# Altium project Smart_Door.PrjPcb (part 1 of 2)
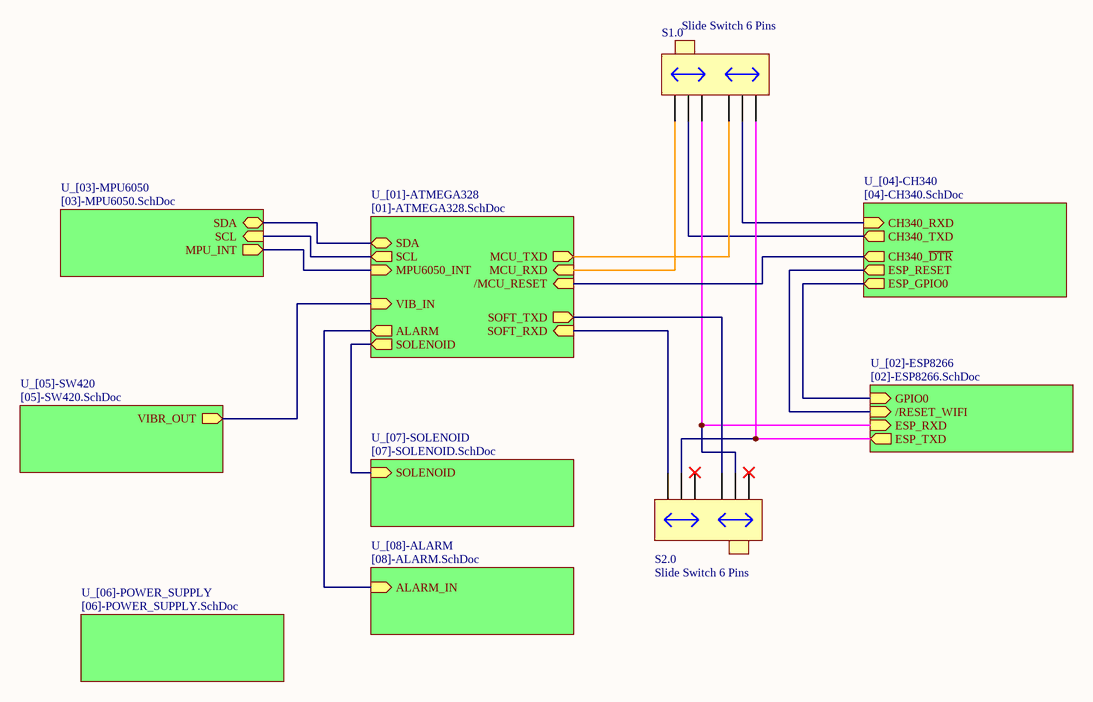
[diagram p0: [00]-Smart_Door.SchDoc]
9 sheets, 111 parts. Net scope: hierarchical (ports join the sheet entries above them; power ports are global).
Board files: Smart_Door.PcbDoc, Smart_Door_Pannel.PcbDoc
Sheets:
  [00]-Smart_Door.SchDoc
    U_[01]-ATMEGA328 = [01]-ATMEGA328.SchDoc
    U_[02]-ESP8266 = [02]-ESP8266.SchDoc
    U_[05]-SW420 = [05]-SW420.SchDoc
    U_[06]-POWER_SUPPLY = [06]-POWER_SUPPLY.SchDoc
    U_[07]-SOLENOID = [07]-SOLENOID.SchDoc
    U_[08]-ALARM = [08]-ALARM.SchDoc
    U_[03]-MPU6050 = [03]-MPU6050.SchDoc
    U_[04]-CH340 = [04]-CH340.SchDoc

## Sheet [00]-Smart_Door.SchDoc
size A4; Organization: Indruino Co., Ltd; Address1: No. 1, Vo Van Ngan Street; Address2: Thu Duc District, HCMC; SheetNumber: 1; SheetTotal: 9

### Parts
S1.0  Slide Switch 6 Pins  [SW6_MSS-22D18]
S2.0  Slide Switch 6 Pins  [SW6_MSS-22D18]

### Sub-sheets
U_[01]-ATMEGA328 = [01]-ATMEGA328.SchDoc: MCU_TXD (out), MCU_RXD (in), ALARM (out), SCL (out), SDA (bidir), SOLENOID (out), VIB_IN (in), SOFT_RXD (in), SOFT_TXD (out), MPU6050_INT (in), /MCU_RESET (in)
U_[02]-ESP8266 = [02]-ESP8266.SchDoc: GPIO0 (in), ESP_TXD (out), ESP_RXD (in), /RESET_WIFI (in)
U_[03]-MPU6050 = [03]-MPU6050.SchDoc: SDA (bidir), SCL (in), MPU_INT (out)
U_[04]-CH340 = [04]-CH340.SchDoc: CH340_TXD (out), CH340_RXD (in), ESP_RESET (out), ESP_GPIO0 (out), CH340_~{DTR} (out)
U_[05]-SW420 = [05]-SW420.SchDoc: VIBR_OUT (out)
U_[06]-POWER_SUPPLY = [06]-POWER_SUPPLY.SchDoc: no entries
U_[07]-SOLENOID = [07]-SOLENOID.SchDoc: SOLENOID (in)
U_[08]-ALARM = [08]-ALARM.SchDoc: ALARM_IN (in)

### Nets
/MCU_RESET: sheet U_[01]-ATMEGA328//MCU_RESET, sheet U_[04]-CH340/CH340_~{DTR}
/RESET_WIFI: sheet U_[02]-ESP8266//RESET_WIFI, sheet U_[04]-CH340/ESP_RESET
ALARM: sheet U_[01]-ATMEGA328/ALARM, sheet U_[08]-ALARM/ALARM_IN
CH340_RXD: S1.0.4(COM) ; sheet U_[04]-CH340/CH340_RXD
CH340_TXD: S1.0.3(COM) ; sheet U_[04]-CH340/CH340_TXD
ESP_GPIO0: sheet U_[02]-ESP8266/GPIO0, sheet U_[04]-CH340/ESP_GPIO0
MCU_RXD: S1.0.1(NC) ; sheet U_[01]-ATMEGA328/MCU_RXD
MCU_TXD: S1.0.2(NC) ; sheet U_[01]-ATMEGA328/MCU_TXD
MPU6050_INT: sheet U_[01]-ATMEGA328/MPU6050_INT, sheet U_[03]-MPU6050/MPU_INT
SCL: sheet U_[01]-ATMEGA328/SCL, sheet U_[03]-MPU6050/SCL
SDA: sheet U_[01]-ATMEGA328/SDA, sheet U_[03]-MPU6050/SDA
SOFT_RXD: S2.0.6(NO) ; sheet U_[01]-ATMEGA328/SOFT_RXD
SOFT_TXD: S2.0.5(NO) ; sheet U_[01]-ATMEGA328/SOFT_TXD
SOLENOID: sheet U_[01]-ATMEGA328/SOLENOID, sheet U_[07]-SOLENOID/SOLENOID
VIB_IN: sheet U_[01]-ATMEGA328/VIB_IN, sheet U_[05]-SW420/VIBR_OUT
NetS1.0_5: S1.0.5(NO) S2.0.3(COM) ; sheet U_[02]-ESP8266/ESP_RXD
NetS1.0_6: S1.0.6(NO) S2.0.4(COM) ; sheet U_[02]-ESP8266/ESP_TXD

Not connected (* = marked no-connect by the designer): S2.0 1(NC)* 2(NC)*

### Notes on the sheet
- Title
- Size:
- Date:
- Author:
- A4
- Time:
- Number:
- Checked:
- Revision:
- Sheet
- Approved:
- of
- File:

### Library data of the parts
S1.0 S2.0 = Slide Switch 6 Pins: Switch; Published: 24-Mar-1999; LatestRevisionDate: 17-Jul-2002; LatestRevisionNote: Re-released for DXP Platform.; PackageReference: SPST-2; Publisher: Altium Limited

## Sheet [01]-ATMEGA328.SchDoc
size A4; Organization: Indruino Co., Ltd; Address1: No. 1, Vo Van Ngan Street; Address2: Thu Duc District, HCMC; SheetNumber: 2; SheetTotal: 9
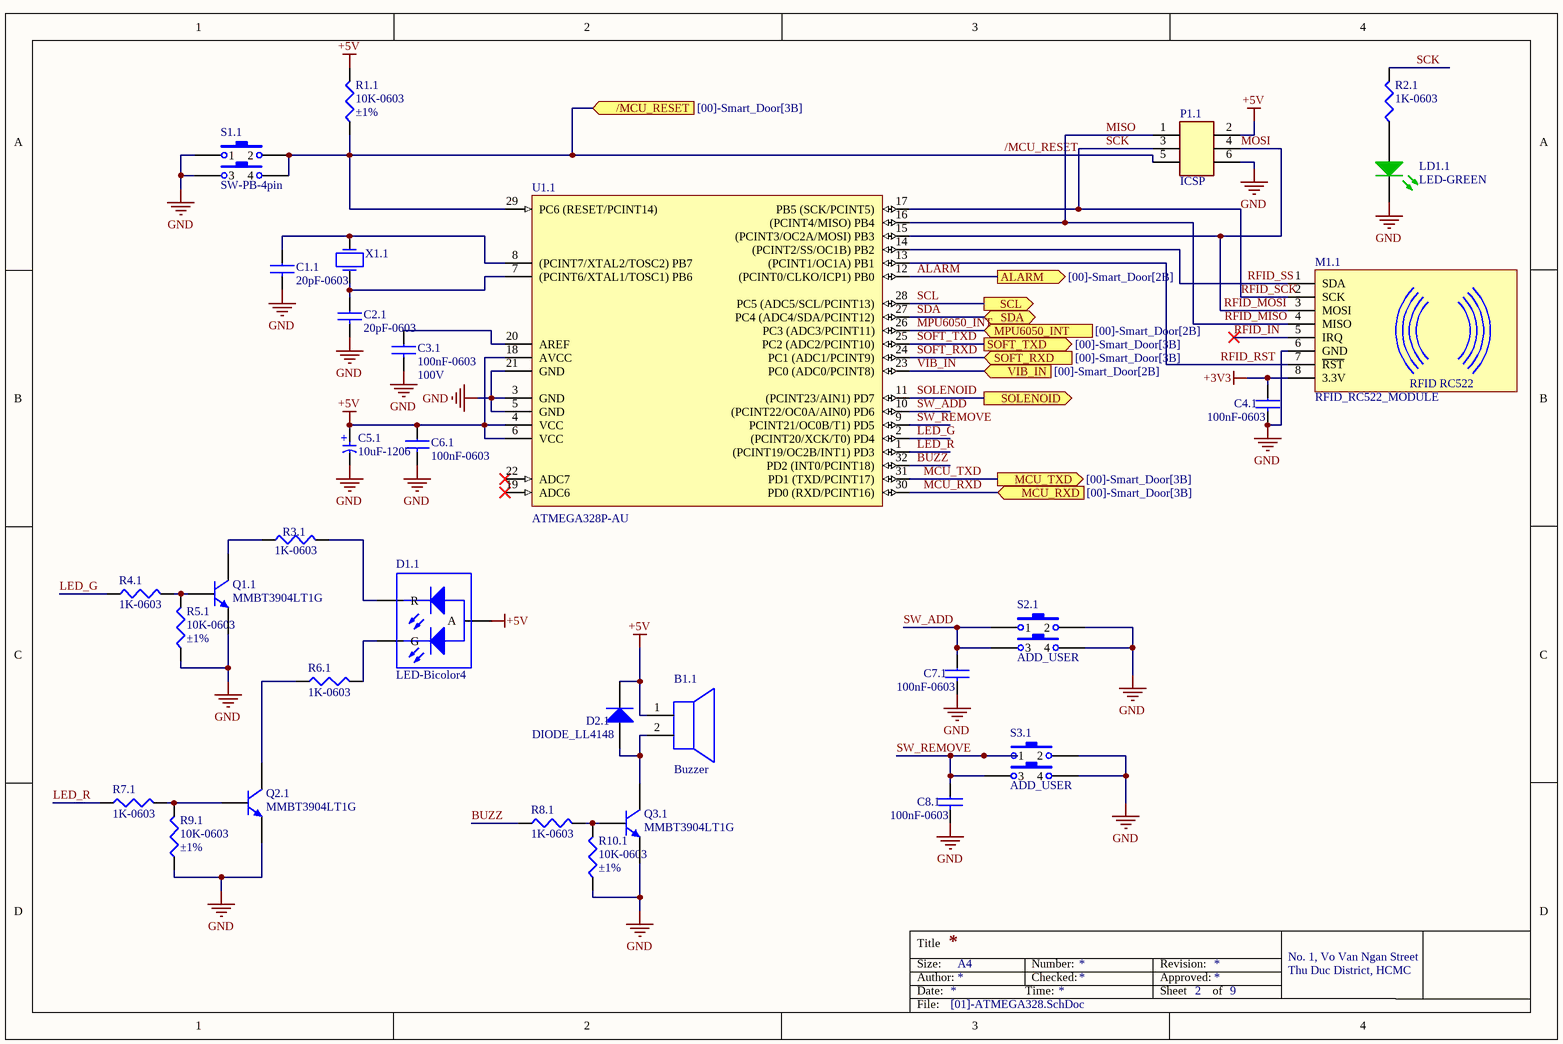
[diagram p1: [01]-ATMEGA328.SchDoc]

### Parts
B1.1  Buzzer  [Buzzer]
C1.1  20pF-0603  [CAP0603]
C2.1  20pF-0603  [CAP0603]
C3.1  100nF-0603  Voltage - Rated: 100V  [CAP0603]
C4.1  100nF-0603  [CAP0603]
C5.1  10uF-1206  [CAP1206_TANT]
C6.1  100nF-0603  [CAP0603]
C7.1  100nF-0603  [CAP0603]
C8.1  100nF-0603  [CAP0603]
D1.1  LED-Bicolor4  [LED_3mm-Bicolor]
D2.1  DIODE_LL4148  [SOD80]
LD1.1  LED-GREEN  [LED_SMD0603_GREEN]
M1.1  RFID_RC522_MODULE  [RFID_RC522_MODULE]
P1.1  ICSP  [HDR3X2_2.54_MALE]
Q1.1  MMBT3904LT1G  [SOT23-3]
Q2.1  MMBT3904LT1G  [SOT23-3]
Q3.1  MMBT3904LT1G  [SOT23-3]
R1.1  10K-0603  Tolerance: ±1%  [RES0603]
R2.1  1K-0603  [RES0603]
R3.1  1K-0603  [RES0603]
R4.1  1K-0603  [RES0603]
R5.1  10K-0603  Tolerance: ±1%  [RES0603]
R6.1  1K-0603  [RES0603]
R7.1  1K-0603  [RES0603]
R8.1  1K-0603  [RES0603]
R9.1  10K-0603  Tolerance: ±1%  [RES0603]
R10.1  10K-0603  Tolerance: ±1%  [RES0603]
S1.1  SW-PB-4pin  [SW4-KAN0647-0312B]
S2.1  ADD_USER  [SW4-KAN0647-0312B]
S3.1  ADD_USER  [SW4-KAN0647-0312B]
U1.1  ATMEGA328P-AU  [TQFP-32]
X1.1  9C-16.000MAAE-T  [XTAL_SMD_HC-49S]  (value not drawn)

### Ports
/MCU_RESET (in, see [00]-Smart_Door[3B]), ALARM (out, see [00]-Smart_Door[2B]), MCU_RXD (in, see [00]-Smart_Door[3B]), MCU_TXD (out, see [00]-Smart_Door[3B]), MPU6050_INT (in, see [00]-Smart_Door[2B]), SCL (out, see [00]-Smart_Door[2B], [03]-MPU6050[1B]), SDA (bidir, see [00]-Smart_Door[2B], [03]-MPU6050[1A]), SOFT_RXD (in, see [00]-Smart_Door[3B]), SOFT_TXD (out, see [00]-Smart_Door[3B]), SOLENOID (out, see [00]-Smart_Door[2B], [07]-SOLENOID[2B]), VIB_IN (in, see [00]-Smart_Door[2B])

### Nets
+3V3: C4.1.1 M1.1.8(3.3V)
+5V: B1.1.1(+) C5.1.1 C6.1.1 D1.1.2(A) D2.1.2(K) P1.1.2 R1.1.2 U1.1.4(VCC) U1.1.6(VCC) U1.1.18(AVCC)
GND: C1.1.2 C2.1.2 C3.1.2 C4.1.2 C5.1.2 C6.1.2 C7.1.2 C8.1.2 LD1.1.2(K) M1.1.6(GND) P1.1.6 Q1.1.2(E) Q2.1.2(E) Q3.1.2(E) R5.1.1 R9.1.1 R10.1.1 S1.1.1 S1.1.3 S2.1.2 S2.1.4 S3.1.2 S3.1.4 U1.1.3(GND) U1.1.5(GND) U1.1.21(GND)
/MCU_RESET: P1.1.5 R1.1.1 S1.1.2 S1.1.4 U1.1.29(PC6_(RESET/PCINT14)) ; port /MCU_RESET
ALARM: U1.1.12((PCINT0/CLKO/ICP1)_PB0) ; port ALARM
BUZZ: R8.1.1 U1.1.32(PD2_(INT0/PCINT18))
LED_G: R4.1.1 U1.1.2((PCINT20/XCK/T0)_PD4)
LED_R: R7.1.1 U1.1.1((PCINT19/OC2B/INT1)_PD3)
MCU_RXD: U1.1.30(PD0_(RXD/PCINT16)) ; port MCU_RXD
MCU_TXD: U1.1.31(PD1_(TXD/PCINT17)) ; port MCU_TXD
MISO: M1.1.4(MISO) P1.1.1 U1.1.16((PCINT4/MISO)_PB4)  [also labelled RFID_MISO]
MOSI: M1.1.3(MOSI) P1.1.4 U1.1.15((PCINT3/OC2A/MOSI)_PB3)  [also labelled RFID_MOSI]
MPU6050_INT: U1.1.26(PC3_(ADC3/PCINT11)) ; port MPU6050_INT
RFID_IN: M1.1.5(IRQ)
RFID_RST: M1.1.7(~{RST}) U1.1.13((PCINT1/OC1A)_PB1)
RFID_SCK: M1.1.2(SCK) P1.1.3 R2.1.2 U1.1.17(PB5_(SCK/PCINT5))  [also labelled SCK]
RFID_SS: M1.1.1(SDA) U1.1.14((PCINT2/SS/OC1B)_PB2)
SCL: U1.1.28(PC5_(ADC5/SCL/PCINT13)) ; port SCL
SDA: U1.1.27(PC4_(ADC4/SDA/PCINT12)) ; port SDA
SOFT_RXD: U1.1.24(PC1_(ADC1/PCINT9)) ; port SOFT_RXD
SOFT_TXD: U1.1.25(PC2_(ADC2/PCINT10)) ; port SOFT_TXD
SOLENOID: U1.1.11((PCINT23/AIN1)_PD7) ; port SOLENOID
SW_ADD: C7.1.1 S2.1.1 S2.1.3 U1.1.10((PCINT22/OC0A/AIN0)_PD6)
SW_REMOVE: C8.1.1 S3.1.1 S3.1.3 U1.1.9(PCINT21/OC0B/T1)_PD5)
VIB_IN: U1.1.23(PC0_(ADC0/PCINT8)) ; port VIB_IN
NetB1.1_2: B1.1.2(-) D2.1.1(A) Q3.1.3(C)
NetC1.1_1: C1.1.1 U1.1.8((PCINT7/XTAL2/TOSC2)_PB7) X1.1.2(OSC2)
NetC2.1_1: C2.1.1 U1.1.7((PCINT6/XTAL1/TOSC1)_PB6) X1.1.1(OSC1)
NetC3.1_1: C3.1.1 U1.1.20(AREF)
NetD1.1_1: D1.1.1(G) R6.1.2
NetD1.1_3: D1.1.3(R) R3.1.2
NetLD1.1_1: LD1.1.1(A) R2.1.1
NetQ1.1_1: Q1.1.1(B) R4.1.2 R5.1.2
NetQ1.1_3: Q1.1.3(C) R3.1.1
NetQ2.1_1: Q2.1.1(B) R7.1.2 R9.1.2
NetQ2.1_3: Q2.1.3(C) R6.1.1
NetQ3.1_1: Q3.1.1(B) R8.1.2 R10.1.2

Not connected (* = marked no-connect by the designer): U1.1 19(ADC6)* 22(ADC7)*

### Notes on the sheet
- Title
- Size:
- Date:
- Author:
- A4
- Time:
- Number:
- Checked:
- Revision:
- Sheet
- Approved:
- of
- File:
- (in symbol RFID_RC522_MODULE) RFID RC522
- (in symbol T491A106K016AT) +

### Library data of the parts
C1.1 C2.1 = CC0603JRNPO9BN200: CAP CER 20PF 50V C0G/NPO 0603; Manufacturer 1: Yageo; Category 1: Capacitors; Tolerance: ±5%; Temperature Coefficient: C0G, NP0; Supplier 1: Digi-Key; Supplier Part Number 1: 311-1424-1-ND; Manufacturer Part Number 1: CC0603JRNPO9BN200; RoHS 1: RoHS Compliant; Description 1: CAP CER 20PF 50V C0G/NPO 0603; Stock 1: 67895; Pricing 1: 1=0.1, 10=0.037, 100=0.0164, 500=0.01172, 1000=0.0092 (USD); Packaging: Cut Tape (CT); Part Status: Active; Capacitance: 20pF; Voltage - Rated: 50V; Operating Temperature: -55°C ~ 125°C; Features: -; Ratings: -; Applications: General Purpose; Failure Rate: -; Mounting Type: Surface Mount, MLCC; Package / Case: 0603 (1608 Metric); Size / Dimension: 0.063" L x 0.031" W (1.60mm x 0.80mm); Height - Seated (Max): -; Thickness (Max): 0.035" (0.90mm); Lead Spacing: -; Lead Style: -; ComponentLink1URL: http://www.yageo.com/documents/recent/UPY-GP_NP0_16V-to-50V_16.pdf; ComponentLink1Description: http://www.yageo.com/documents/recent/UPY-GP_NP0_16V-to-50V_16.pdf; Value: 20pF
C3.1 C6.1 = CC0603KRX7R0BB104: CAP CER 0.1UF 100V X7R 0603; Manufacturer: Yageo; Tolerance: ±10%; Value: 100nF; Supplier 1: Digi-Key; Manufacturer Part Number: CC0603KRX7R0BB104; RoHS: RoHS Compliant; Category: Capacitors; Stock 1: 784508; Pricing 1: 1=0.23, 10=0.156, 100=0.0791, 500=0.05414, 1000=0.0479 (USD); Packaging: Cut Tape (CT); Part Status: Active; Temperature Coefficient: X7R; Operating Temperature: -55°C ~ 125°C; Features: -; Ratings: -; Applications: General Purpose; Failure Rate: -; Mounting Type: Surface Mount, MLCC; Package / Case: 0603 (1608 Metric); Size / Dimension: 0.063" L x 0.032" W (1.60mm x 0.80mm); Height - Seated (Max): -; Thickness (Max): 0.035" (0.90mm); Lead Spacing: -; Lead Style: -; ComponentLink1URL: http://media.digikey.com/pdf/Data%20Sheets/Yageo%20PDFs/NPO,%20X7R%20Mid-voltage.pdf; ComponentLink1Description: http://media.digikey.com/pdf/Data%20Sheets/Yageo%20PDFs/NPO,%20X7R%20Mid-voltage.pdf; Supplier Part Number 1: 311-1523-1-ND
  C6.1: Voltage - Rated: 100V
C4.1 C7.1 C8.1 = CC0603KRX7R9BB104: CAP CER 0.1UF 50V X7R 0603; Manufacturer 1: Yageo; Category 1: Capacitors; Capacitance: 0.1µF; Tolerance: ±10%; Value: 100nF; Supplier 1: Digi-Key; Supplier Part Number 1: 311-1344-1-ND; Manufacturer Part Number 1: CC0603KRX7R9BB104; RoHS 1: RoHS Compliant; Description 1: CAP CER 0.1UF 50V X7R 0603; Stock 1: 4411645; Pricing 1: 1=0.1, 10=0.031, 100=0.014, 500=0.00998, 1000=0.00783 (USD); Packaging: Cut Tape (CT); Part Status: Active; Voltage - Rated: 50V; Temperature Coefficient: X7R; Operating Temperature: -55°C ~ 125°C; Features: -; Ratings: -; Applications: General Purpose; Failure Rate: -; Mounting Type: Surface Mount, MLCC; Package / Case: 0603 (1608 Metric); Size / Dimension: 0.063" L x 0.031" W (1.60mm x 0.80mm); Height - Seated (Max): -; Thickness (Max): 0.035" (0.90mm); Lead Spacing: -; Lead Style: -; ComponentLink1URL: http://www.yageo.com/documents/recent/UPY-GPHC_X7R_6.3V-to-50V_18.pdf; ComponentLink1Description: http://www.yageo.com/documents/recent/UPY-GPHC_X7R_6.3V-to-50V_18.pdf
C5.1 = T491A106K016AT: Cap Tant Solid 10uF 16V A CASE 10% (3.2 X 1.6 X 1.6mm) Inward L SMD 3216-18 3 Ohm 125C T/R; Manufacturer 1: KEMET; Dielectric Material: Tantalum; ESR (Equivalent Series Resistance): 7R; Ripple Current: 104mA; Leakage Current: 1.6uA; Polarity: Polar; Life (Hours): 2000Hour; Supplier 1: Digi-Key; Supplier Part Number 1: 399-8269-1-ND; Manufacturer Part Number 1: T491A106K016AT; RoHS 1: Yes; Description 1: Cap Tant Solid 10uF 16V A CASE 10% (3.2 X 1.6 X 1.6mm) Inward L SMD 3216-18 3 Ohm 125C T/R; Category: Tantalum Capacitors; Stock 1: 3206; Pricing 1: 1=0.45000, 10=0.31300, 50=0.21900, 100=0.18780, 500=0.14082, 1000=0.11892 (USD); Mount: Surface Mount,PCB; Case/Package: 1206; Number of Pins: 2; Case Code (Metric): 3216; Case Code (Imperial): 1206; Min Operating Temperature: -55°C; Max Operating Temperature: 125°C; Capacitance: 10uF; Tolerance: 10%; Voltage Rating: 16V; Packaging: Tape and Reel; Termination: SMD/SMT; Voltage: 16V; Package Quantity: 1; Voltage Rating (DC): 16V; Dissipation Factor: 10%; Failure Rate: 0.001%; Features: General Purpose; Length: 3.2mm; Width: 1.6mm; Height: 1.6mm; Depth: 1.6mm; Height - Seated (Max): 0.071inch; Lead Pitch: 1.2mm; Radiation Hardening: No; RoHS Compliant: Yes; REACH SVHC: No SVHC; Lead Free: Lead Free; ComponentLink1URL: https://datasheet.ciiva.com/7696/1732745-7696294.pdf?src-supplier=Element14; ComponentLink1Description: https://datasheet.ciiva.com/7696/1732745-7696294.pdf?src-supplier=Element14; ComponentLink2URL: https://datasheet.ciiva.com/34302/1573257-34302505.pdf?src-supplier=Jameco; ComponentLink2Description: https://datasheet.ciiva.com/34302/1573257-34302505.pdf?src-supplier=Jameco; ComponentLink3URL: https://datasheet.ciiva.com/7696/1923792-7696431.pdf?src-supplier=Element14; ComponentLink3Description: https://datasheet.ciiva.com/7696/1923792-7696431.pdf?src-supplier=Element14; ComponentLink4URL: https://datasheet.ciiva.com/7696/1854511-7696295.pdf?src-supplier=Element14; ComponentLink4Description: https://datasheet.ciiva.com/7696/1854511-7696295.pdf?src-supplier=Element14; ComponentLink5URL: https://datasheet.ciiva.com/14113/t491serie-eng-tds-14113132.pdf?src-supplier=Distrelec; ComponentLink5Description: https://datasheet.ciiva.com/14113/t491serie-eng-tds-14113132.pdf?src-supplier=Distrelec; ComponentLink6URL: https://datasheet.ciiva.com/7696/1446014-7696296.pdf?src-supplier=Element14; ComponentLink6Description: https://datasheet.ciiva.com/7696/1446014-7696296.pdf?src-supplier=Element14; ComponentLink7URL: https://datasheet.ciiva.com/7696/1854511-7696293.pdf?src-supplier=Element14; ComponentLink7Description: https://datasheet.ciiva.com/7696/1854511-7696293.pdf?src-supplier=Element14; ComponentLink8URL: https://datasheet.ciiva.com/6248/kem-t2005-t491-6248088.pdf?src-supplier=Digi-Key; ComponentLink8Description: https://datasheet.ciiva.com/6248/kem-t2005-t491-6248088.pdf?src-supplier=Digi-Key; ComponentLink9URL: https://datasheet.ciiva.com/6248/kem-t2005-t491-6248087.pdf?src-supplier=Digi-Key; ComponentLink9Description: https://datasheet.ciiva.com/6248/kem-t2005-t491-6248087.pdf?src-supplier=Digi-Key; ComponentLink10URL: https://datasheet.ciiva.com/6248/kem-t2005-t491-6248089.pdf?src-supplier=Digi-Key; ComponentLink10Description: https://datasheet.ciiva.com/6248/kem-t2005-t491-6248089.pdf?src-supplier=Digi-Key; ComponentLink11URL: https://datasheet.ciiva.com/14586/70095774-14586694.pdf?src-supplier=Allied+Electronics; ComponentLink11Description: https://datasheet.ciiva.com/14586/70095774-14586694.pdf?src-supplier=Allied+Electronics; ComponentLink12URL: https://datasheet.ciiva.com/14605/70095774-14605543.pdf?src-supplier=Allied+Electronics; ComponentLink12Description: https://datasheet.ciiva.com/14605/70095774-14605543.pdf?src-supplier=Allied+Electronics; ComponentLink13URL: https://datasheet.ciiva.com/12882/kem-t2005-t491-12882730.pdf?src-supplier=Mouser; ComponentLink13Description: https://datasheet.ciiva.com/12882/kem-t2005-t491-12882730.pdf?src-supplier=Mouser; ComponentLink14URL: https://datasheet.ciiva.com/29244/458306-da-01-de-kondensator-10uf-3216-10pr-16v-85c-29244588.pdf?src-supplier=Conrad; ComponentLink14Description: https://datasheet.ciiva.com/29244/458306-da-01-de-kondensator-10uf-3216-10pr-16v-85c-29244588.pdf?src-supplier=Conrad
D1.1 = LED-Bicolor4: Common Anode; Published: 8-Jun-2000; LatestRevisionDate: 08-Jul-2005; LatestRevisionNote: Mech Layer 1 removed.; PackageReference: LED-0; Publisher: Altium Limited
D2.1 = DIODE_LL4148: DIODE GEN PURP 100V 200MA SOD80; Manufacturer: Fairchild/ON Semiconductor; Manufacturer Part Number: LL4148; Diode Type: Standard; Voltage - Forward (Vf) (Max) @ If: 1V @ 10mA; Speed: Small Signal =< 200mA (Io), Any Speed; Current - Reverse Leakage @ Vr: 25nA @ 20V; Capacitance @ Vr, F: 4pF @ 0V, 1MHz; Supplier 1: Digi-Key; RoHS: RoHS Compliant; Category: Discrete Semiconductor Products; Stock 1: 494912; Pricing 1: 1=0.1, 10=0.095, 100=0.0518, 500=0.03188, 1000=0.02174 (USD); Packaging: Cut Tape (CT); Part Status: Active; Current - Average Rectified (Io): 200mA; Mounting Type: Surface Mount; Package / Case: DO-213AC, MINI-MELF, SOD-80; Supplier Device Package: SOD-80; Operating Temperature - Junction: -55°C ~ 175°C; ComponentLink1URL: https://www.fairchildsemi.com/datasheets/LL/LL4148.pdf; ComponentLink1Description: https://www.fairchildsemi.com/datasheets/LL/LL4148.pdf; Supplier Part Number 1: LL4148FSCT-ND
LD1.1 = LED_LTST-C191KGKT: LED GREEN CLEAR 0603 SMD; Manufacturer 1: Lite-On Inc.; Category 1: Optoelectronics; Lens Color: Colorless; Millicandela Rating: 35mcd; Lens Style/Size: Rectangle with Flat Top, 1.10mm x 0.80mm; Voltage - Forward (Vf) (Typ): 2V; Current - Test: 20mA; Viewing Angle: 130°; Wavelength - Dominant: 571nm; Wavelength - Peak: 574nm; Supplier 1: Digi-Key; Supplier Part Number 1: 160-1446-1-ND; Manufacturer Part Number 1: LTST-C191KGKT; RoHS 1: RoHS Compliant; Description 1: LED GREEN CLEAR 0603 SMD; Stock 1: 1325167; Pricing 1: 1=0.29, 10=0.211, 25=0.1556, 100=0.1111, 250=0.07556, 500=0.06666, 1000=0.05222, 2500=0.05111 (USD); Packaging: Cut Tape (CT); Part Status: Active; Color: Green; Lens Transparency: Clear; Mounting Type: Surface Mount; Features: -; Size / Dimension: 1.60mm L x 0.80mm W; Height (Max): 0.55mm; ComponentLink1URL: http://optoelectronics.liteon.com/upload/download/DS22-2000-228/S_110_LTST-C191KGKT.pdf; ComponentLink1Description: http://optoelectronics.liteon.com/upload/download/DS22-2000-228/S_110_LTST-C191KGKT.pdf; Package / Case: 0603 (1608 Metric)
P1.1 = HDR3X2_2.54_MALE: Header 3x2 pins male, pitch 2.54mm
Q1.1 Q2.1 Q3.1 = MMBT3904LT1G: TRANS NPN 40V 0.2A SOT23; Manufacturer 1: ON Semiconductor; Category 1: Discrete Semiconductor Products; Current - Collector (Ic) (Max): 200mA; Vce Saturation (Max) @ Ib, Ic: 300mV @ 5mA, 50mA; DC Current Gain (hFE) (Min) @ Ic, Vce: 100 @ 10mA, 1V; Power - Max: 300mW; Frequency - Transition: 300MHz; Supplier 1: Digi-Key; Supplier Part Number 1: MMBT3904LT1GOSCT-ND; Manufacturer Part Number 1: MMBT3904LT1G; RoHS 1: RoHS Compliant; Description 1: TRANS NPN 40V 0.2A SOT23; Stock 1: 366071; Pricing 1: 1=0.11, 10=0.103, 100=0.0562, 500=0.03456, 1000=0.02356 (USD); Packaging: Cut Tape (CT); Part Status: Active; Transistor Type: NPN; Voltage - Collector Emitter Breakdown (Max): 40V; Current - Collector Cutoff (Max): -; Operating Temperature: -55°C ~ 150°C (TJ); Mounting Type: Surface Mount; Package / Case: TO-236-3, SC-59, SOT-23-3; Supplier Device Package: SOT-23-3 (TO-236); ComponentLink1URL: http://www.onsemi.com/pub_link/Collateral/MMBT3904LT1-D.PDF; ComponentLink1Description: http://www.onsemi.com/pub_link/Collateral/MMBT3904LT1-D.PDF
R1.1 R5.1 R9.1 R10.1 = RC0603FR-0710KL: RES SMD 10K OHM 1% 1/10W 0603; Manufacturer: Yageo; Power (Watts): 0.1W, 1/10W; Temperature Coefficient: ±100ppm/°C; Supplier 1: Digi-Key; Manufacturer Part Number: RC0603FR-0710KL; RoHS: RoHS Compliant; Category: Resistors; Stock 1: 16545228; Pricing 1: 1=0.1, 10=0.015, 100=0.006, 1000=0.00268, 2500=0.00233 (USD); Packaging: Cut Tape (CT); Part Status: Active; Composition: Thick Film; Features: Moisture Resistant; Operating Temperature: -55°C ~ 155°C; Package / Case: 0603 (1608 Metric); Supplier Device Package: 0603; Size / Dimension: 0.063" L x 0.032" W (1.60mm x 0.80mm); Height - Seated (Max): 0.022" (0.55mm); Failure Rate: -; ComponentLink1URL: http://www.yageo.com/documents/recent/PYu-RC_Group_51_RoHS_L_7.pdf; ComponentLink1Description: http://www.yageo.com/documents/recent/PYu-RC_Group_51_RoHS_L_7.pdf; Supplier Part Number 1: 311-10.0KHRCT-ND; Value: 10K
R2.1 R3.1 R4.1 R6.1 R7.1 R8.1 = RC0603JR-071KL: RES SMD 1K OHM 5% 1/10W 0603; Manufacturer 1: Yageo; Category 1: Resistors; Power (Watts): 0.1W, 1/10W; Temperature Coefficient: ±100ppm/°C; Supplier 1: Digi-Key; Supplier Part Number 1: 311-1.0KGRCT-ND; Manufacturer Part Number 1: RC0603JR-071KL; RoHS 1: RoHS Compliant; Description 1: RES SMD 1K OHM 5% 1/10W 0603; Stock 1: 2853955; Pricing 1: 1=0.1, 10=0.011, 100=0.0044, 1000=0.00198, 2500=0.00172 (USD); Packaging: Cut Tape (CT); Part Status: Active; Resistance (Ohms): 1k; Tolerance: ±5%; Composition: Thick Film; Features: Moisture Resistant; Operating Temperature: -55°C ~ 155°C; Package / Case: 0603 (1608 Metric); Supplier Device Package: 0603; Size / Dimension: 0.063" L x 0.031" W (1.60mm x 0.80mm); Height - Seated (Max): 0.022" (0.55mm); Failure Rate: -; ComponentLink1URL: http://www.yageo.com/documents/recent/PYu-RC_Group_51_RoHS_L_7.pdf; ComponentLink1Description: http://www.yageo.com/documents/recent/PYu-RC_Group_51_RoHS_L_7.pdf; Value: 1K
S1.1 S2.1 S3.1 = SW-PB-4pin: Switch; Published: 24-Mar-1999; LatestRevisionDate: 17-Jul-2002; LatestRevisionNote: Re-released for DXP Platform.; PackageReference: SPST-2; Publisher: Altium Limited
U1.1 = ATMEGA328P-AU: MICROCHIP - ATMEGA328P-AU. - MICROCONTROLLER MCU, 8 BIT, ATMEGA, 20MHZ, TQFP-32; Manufacturer 1: Microchip / Atmel; Interface: I2C,SPI,USART; Number of I/Os: 23; Oscillator Type: Internal; Memory Type: FLASH; Memory Size: 32KB; Peripherals: Brown-out Detect/Reset,POR,PWM,WDT; Core Architecture: AVR; RAM Size: 2KB; Max Supply Voltage: 5.5V; Min Supply Voltage: 1.8V; Number of Timers/Counters: 3; Data Bus Width: 8b; Watchdog Timer: Yes; Number of ADC Channels: 8; Number of PWM Channels: 6; Number of SPI Channels: 1; Supplier 1: Avnet; Supplier Part Number 1: 68T2935; Manufacturer Part Number 1: ATMEGA328P-AU; RoHS 1: Yes; Description 1: MICROCHIP - ATMEGA328P-AU. - MICROCONTROLLER MCU, 8 BIT, ATMEGA, 20MHZ, TQFP-32; Category: Microcontrollers; Mount: Surface Mount; Case/Package: A; Number of Pins: 32; Weight: 0.002469oz; Min Operating Temperature: -40°C; Max Operating Temperature: 85°C; Packaging: Tray; Frequency: 20MHz; Package Quantity: 250; Number of Programmable I/O: 23; Max Frequency: 20MHz; Series: ATmega328P; Number of I2C Channels: 1; Length: 7mm; Width: 7mm; Height: 1mm; Radiation Hardening: No; RoHS Compliant: Yes; REACH SVHC: No SVHC; Lead Free: Lead Free; ComponentLink1URL: https://datasheet.ciiva.com/1166/doc8161-1166860.pdf?src-supplier=Newark; ComponentLink1Description: https://datasheet.ciiva.com/1166/doc8161-1166860.pdf?src-supplier=Newark; ComponentLink2URL: https://datasheet.ciiva.com/29119/155196-da-01-en-microcontr-atmega328p-au-8bit-tqfp-32-29119594.pdf?src-supplier=Conrad; ComponentLink2Description: https://datasheet.ciiva.com/29119/155196-da-01-en-microcontr-atmega328p-au-8bit-tqfp-32-29119594.pdf?src-supplier=Conrad; ComponentLink3URL: https://datasheet.ciiva.com/15213/getdatasheetpartid-365828-15213131.pdf?src-supplier=Verical; ComponentLink3Description: https://datasheet.ciiva.com/15213/getdatasheetpartid-365828-15213131.pdf?src-supplier=Verical; ComponentLink4URL: https://datasheet.ciiva.com/1157/1693866-1157693.pdf?src-supplier=Element14; ComponentLink4Description: https://datasheet.ciiva.com/1157/1693866-1157693.pdf?src-supplier=Element14
X1.1 = XTAL_9C-16.000MAAE-T: CRYSTAL 16.0000MHZ 12PF SMD; Manufacturer: TXC CORPORATION; Frequency Stability: ±30ppm; Operating Mode: Fundamental; Supplier 1: Digi-Key; Manufacturer Part Number: 9C-16.000MAAE-T; RoHS: RoHS Compliant; Category: Crystals, Oscillators, Resonators; Stock 1: 1452; Pricing 1: 1=0.4, 10=0.33, 50=0.297, 100=0.264, 500=0.2508 (USD); Packaging: Cut Tape (CT); Part Status: Active; Type: MHz Crystal; Frequency Tolerance: ±30ppm; Load Capacitance: 12pF; Operating Temperature: -20°C ~ 70°C; Ratings: -; Mounting Type: Surface Mount; Package / Case: HC-49S; Size / Dimension: 0.449" L x 0.189" W (11.40mm x 4.80mm); Height - Seated (Max): 0.161" (4.10mm); ComponentLink1URL: http://www.txccorp.com/download/products/quartz_crystals/2015TXC_9C_32.pdf; ComponentLink1Description: http://www.txccorp.com/download/products/quartz_crystals/2015TXC_9C_32.pdf; Supplier Part Number 1: 887-2423-1-ND

## Sheet [02]-ESP8266.SchDoc
size A4; Organization: Indruino Co., Ltd; Address1: No. 1, Vo Van Ngan Street; Address2: Thu Duc District, HCMC; SheetNumber: 3; SheetTotal: 9
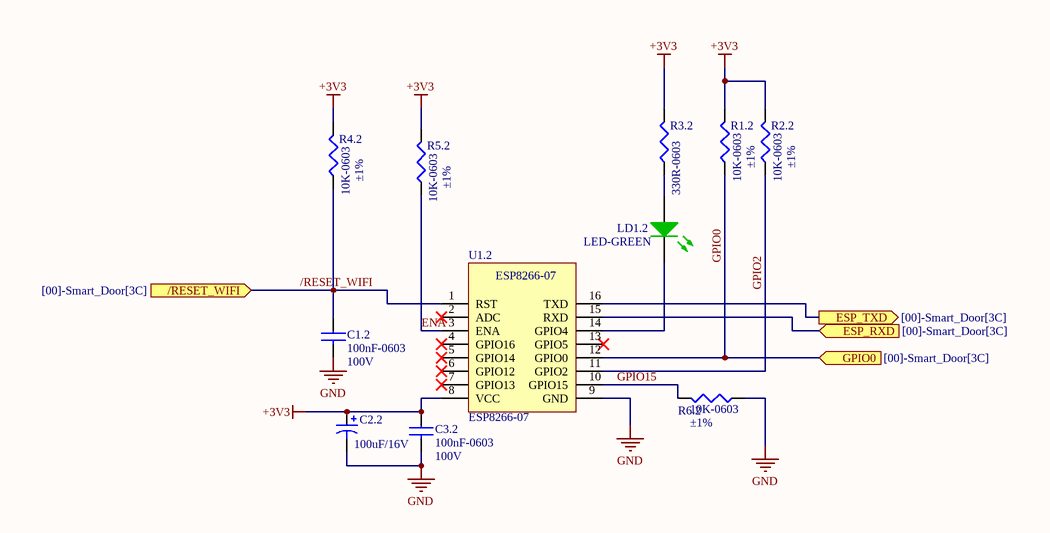
[diagram p2: [02]-ESP8266.SchDoc]

### Parts
C1.2  100nF-0603  Voltage - Rated: 100V  [CAP0603]
C2.2  100uF/16V  [CAPPR5-13x20]
C3.2  100nF-0603  Voltage - Rated: 100V  [CAP0603]
LD1.2  LED-GREEN  [LED_SMD0603_GREEN]
R1.2  10K-0603  Tolerance: ±1%  [RES0603]
R2.2  10K-0603  Tolerance: ±1%  [RES0603]
R3.2  330R-0603  [RES0603]
R4.2  10K-0603  Tolerance: ±1%  [RES0603]
R5.2  10K-0603  Tolerance: ±1%  [RES0603]
R6.2  10K-0603  Tolerance: ±1%  [RES0603]
U1.2  ESP8266-07  [ESP8266-07_MODULE]

### Ports
/RESET_WIFI (in, see [00]-Smart_Door[3C]), ESP_RXD (in, see [00]-Smart_Door[3C]), ESP_TXD (out, see [00]-Smart_Door[3C]), GPIO0 (in, see [00]-Smart_Door[3C])

### Nets
+3V3: C2.2.1 C3.2.1 R1.2.2 R2.2.2 R3.2.2 R4.2.2 R5.2.2 U1.2.8(VCC)
GND: C1.2.2 C2.2.2 C3.2.2 R6.2.1 U1.2.9(GND)
/RESET_WIFI: C1.2.1 R4.2.1 U1.2.1(RST) ; port /RESET_WIFI
ENA: R5.2.1 U1.2.3(ENA)
GPIO0: R1.2.1 U1.2.12(GPIO0) ; port GPIO0  [project net ESP_GPIO0]
GPIO2: R2.2.1 U1.2.11(GPIO2)
GPIO15: R6.2.2 U1.2.10(GPIO15)
NetLD1.2_1: LD1.2.1(A) R3.2.1
NetLD1.2_2: LD1.2.2(K) U1.2.14(GPIO4)
NetS1.0_5: U1.2.15(RXD) ; port ESP_RXD
NetS1.0_6: U1.2.16(TXD) ; port ESP_TXD

Not connected (* = marked no-connect by the designer): U1.2 2(ADC)* 4(GPIO16)* 5(GPIO14)* 6(GPIO12)* 7(GPIO13)* 13(GPIO5)*

### Notes on the sheet
- Title
- Size:
- Date:
- Author:
- A4
- Time:
- Number:
- Checked:
- Revision:
- Sheet
- Approved:
- of
- File:

### Library data of the parts
C1.2 C3.2 = CC0603KRX7R0BB104: as C3.1 on sheet [01]-ATMEGA328; Supplier 1: Digi-Key; Manufacturer Part Number: CC0603KRX7R0BB104; RoHS: RoHS Compliant; Category: Capacitors; Stock 1: 784508; Pricing 1: 1=0.23, 10=0.156, 100=0.0791, 500=0.05414, 1000=0.0479 (USD); Packaging: Cut Tape (CT); Part Status: Active; Temperature Coefficient: X7R; Operating Temperature: -55°C ~ 125°C; Features: -; Ratings: -; Applications: General Purpose; Failure Rate: -; Mounting Type: Surface Mount, MLCC; Package / Case: 0603 (1608 Metric); Size / Dimension: 0.063" L x 0.032" W (1.60mm x 0.80mm); Height - Seated (Max): -; Thickness (Max): 0.035" (0.90mm); Lead Spacing: -; Lead Style: -; ComponentLink1URL: http://media.digikey.com/pdf/Data%20Sheets/Yageo%20PDFs/NPO,%20X7R%20Mid-voltage.pdf; ComponentLink1Description: http://media.digikey.com/pdf/Data%20Sheets/Yageo%20PDFs/NPO,%20X7R%20Mid-voltage.pdf; Supplier Part Number 1: 311-1523-1-ND
C2.2 = Cap Polar: Polarized Capacitor; Published: 8-Jun-2000; LatestRevisionDate: 17-Jul-2002; LatestRevisionNote: Re-released for DXP Platform.; PackageReference: POLAR0.8; Publisher: Altium Limited; Value: 100uF/16V
LD1.2 = LED_LTST-C191KGKT: as LD1.1 on sheet [01]-ATMEGA328; Supplier 1: Digi-Key; Supplier Part Number 1: 160-1446-1-ND; Manufacturer Part Number 1: LTST-C191KGKT; RoHS 1: RoHS Compliant; Description 1: LED GREEN CLEAR 0603 SMD; Stock 1: 1325167; Pricing 1: 1=0.29, 10=0.211, 25=0.1556, 100=0.1111, 250=0.07556, 500=0.06666, 1000=0.05222, 2500=0.05111 (USD); Packaging: Cut Tape (CT); Part Status: Active; Color: Green; Lens Transparency: Clear; Mounting Type: Surface Mount; Features: -; Size / Dimension: 1.60mm L x 0.80mm W; Height (Max): 0.55mm; ComponentLink1URL: http://optoelectronics.liteon.com/upload/download/DS22-2000-228/S_110_LTST-C191KGKT.pdf; ComponentLink1Description: http://optoelectronics.liteon.com/upload/download/DS22-2000-228/S_110_LTST-C191KGKT.pdf; Package / Case: 0603 (1608 Metric)
R1.2 R2.2 R4.2 R5.2 R6.2 = RC0603FR-0710KL: as R1.1 on sheet [01]-ATMEGA328; Supplier 1: Digi-Key; Manufacturer Part Number: RC0603FR-0710KL; RoHS: RoHS Compliant; Category: Resistors; Stock 1: 16545228; Pricing 1: 1=0.1, 10=0.015, 100=0.006, 1000=0.00268, 2500=0.00233 (USD); Packaging: Cut Tape (CT); Part Status: Active; Composition: Thick Film; Features: Moisture Resistant; Operating Temperature: -55°C ~ 155°C; Package / Case: 0603 (1608 Metric); Supplier Device Package: 0603; Size / Dimension: 0.063" L x 0.032" W (1.60mm x 0.80mm); Height - Seated (Max): 0.022" (0.55mm); Failure Rate: -; ComponentLink1URL: http://www.yageo.com/documents/recent/PYu-RC_Group_51_RoHS_L_7.pdf; ComponentLink1Description: http://www.yageo.com/documents/recent/PYu-RC_Group_51_RoHS_L_7.pdf; Supplier Part Number 1: 311-10.0KHRCT-ND; Value: 10K
R3.2 = RC0603JR-07330RL: RES SMD 330 OHM 5% 1/10W 0603; Manufacturer 1: Yageo; Category 1: Resistors; Resistance (Ohms): 330; Power (Watts): 0.1W, 1/10W; Temperature Coefficient: ±100ppm/°C; Value: 330R; Supplier 1: Digi-Key; Supplier Part Number 1: 311-330GRCT-ND; Manufacturer Part Number 1: RC0603JR-07330RL; RoHS 1: RoHS Compliant; Description 1: RES SMD 330 OHM 5% 1/10W 0603; Stock 1: 1463213; Pricing 1: 1=0.1, 10=0.011, 100=0.0046, 1000=0.00207, 2500=0.0018 (USD); Packaging: Cut Tape (CT); Part Status: Active; Tolerance: ±5%; Composition: Thick Film; Features: Moisture Resistant; Operating Temperature: -55°C ~ 155°C; Package / Case: 0603 (1608 Metric); Supplier Device Package: 0603; Size / Dimension: 0.063" L x 0.031" W (1.60mm x 0.80mm); Height - Seated (Max): 0.022" (0.55mm); Failure Rate: -; ComponentLink1URL: http://www.yageo.com/documents/recent/PYu-RC_Group_51_RoHS_L_7.pdf; ComponentLink1Description: http://www.yageo.com/documents/recent/PYu-RC_Group_51_RoHS_L_7.pdf
U1.2 = ESP8266-07: WIFI ESP8266 07

## Sheet [05]-SW420.SchDoc
size A4; Organization: Indruino Co., Ltd; Address1: No. 1, Vo Van Ngan Street; Address2: Thu Duc District, HCMC; SheetNumber: 6; SheetTotal: 9
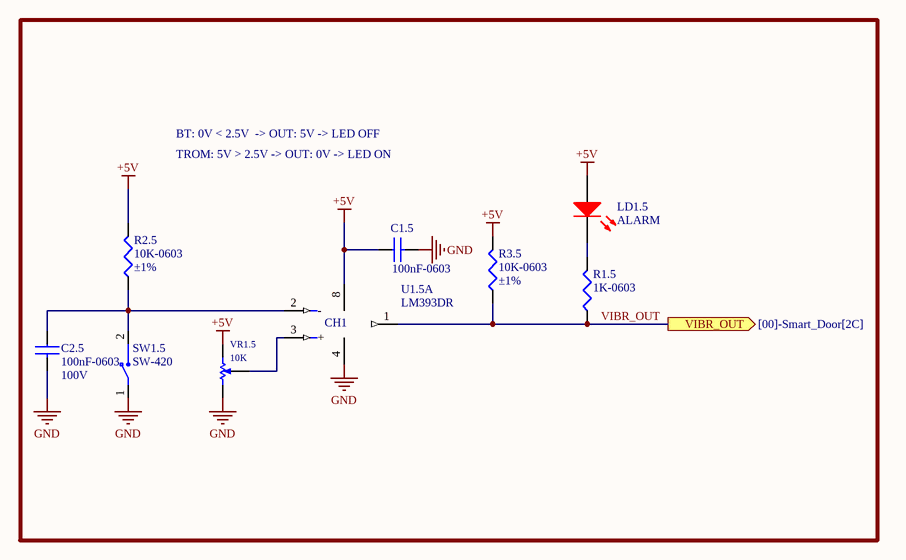
[diagram p3: [05]-SW420.SchDoc]

### Parts
C1.5  100nF-0603  [CAP0603]
C2.5  100nF-0603  Voltage - Rated: 100V  [CAP0603]
LD1.5  ALARM  [LED_SMD0603_RED]
R1.5  1K-0603  [RES0603]
R2.5  10K-0603  Tolerance: ±1%  [RES0603]
R3.5  10K-0603  Tolerance: ±1%  [RES0603]
SW1.5  SW-420  [SW-420]
U1.5  LM393DR  [SOP8]  (part A of 2)
VR1.5  10K  [VARIABLE RESISTOR_3362P]

### Ports
VIBR_OUT (out, see [00]-Smart_Door[2C])

### Nets
+5V: C1.5.1 LD1.5.1(A) R2.5.2 R3.5.2 U1.5.8(VCC) VR1.5.1
GND: C1.5.2 C2.5.2 SW1.5.1 U1.5.4(GND) VR1.5.3
VIBR_OUT: R1.5.1 R3.5.1 U1.5.1(OUT1) ; port VIBR_OUT  [project net VIB_IN]
NetC2.5_1: C2.5.1 R2.5.1 SW1.5.2 U1.5.2(-)
NetLD1.5_2: LD1.5.2(K) R1.5.2
NetU1.5_3: U1.5.3(+) VR1.5.2

### Notes on the sheet
- BT: 0V < 2.5V  -> OUT: 5V -> LED OFF
- TROM: 5V > 2.5V -> OUT: 0V -> LED ON
- Title
- Size:
- Date:
- Author:
- A4
- Time:
- Number:
- Checked:
- Revision:
- Sheet
- Approved:
- of
- File:
- (in symbol LM393DR, part A) CH1

### Library data of the parts
C1.5 C2.5 = CC0603KRX7R0BB104: as C3.1 on sheet [01]-ATMEGA328; Supplier 1: Digi-Key; Manufacturer Part Number: CC0603KRX7R0BB104; RoHS: RoHS Compliant; Category: Capacitors; Stock 1: 784508; Pricing 1: 1=0.23, 10=0.156, 100=0.0791, 500=0.05414, 1000=0.0479 (USD); Packaging: Cut Tape (CT); Part Status: Active; Temperature Coefficient: X7R; Operating Temperature: -55°C ~ 125°C; Features: -; Ratings: -; Applications: General Purpose; Failure Rate: -; Mounting Type: Surface Mount, MLCC; Package / Case: 0603 (1608 Metric); Size / Dimension: 0.063" L x 0.032" W (1.60mm x 0.80mm); Height - Seated (Max): -; Thickness (Max): 0.035" (0.90mm); Lead Spacing: -; Lead Style: -; ComponentLink1URL: http://media.digikey.com/pdf/Data%20Sheets/Yageo%20PDFs/NPO,%20X7R%20Mid-voltage.pdf; ComponentLink1Description: http://media.digikey.com/pdf/Data%20Sheets/Yageo%20PDFs/NPO,%20X7R%20Mid-voltage.pdf; Supplier Part Number 1: 311-1523-1-ND
  C1.5: Voltage - Rated: 100V
LD1.5 = LED_LTST-C191KRKT: LED RED CLEAR 0603 SMD; Manufacturer: Lite-On Inc.; Lens Color: Colorless; Millicandela Rating: 54mcd; Lens Style/Size: Rectangle with Flat Top, 1.10mm x 0.80mm; Voltage - Forward (Vf) (Typ): 2V; Current - Test: 20mA; Viewing Angle: 130°; Wavelength - Dominant: 631nm; Wavelength - Peak: 639nm; Supplier 1: Digi-Key; Manufacturer Part Number: LTST-C191KRKT; RoHS: RoHS Compliant; Category: Optoelectronics; Stock 1: 711347; Pricing 1: 1=0.29, 10=0.211, 25=0.1556, 100=0.1111, 250=0.07556, 500=0.06666, 1000=0.05222, 2500=0.05111 (USD); Packaging: Digi-Reel®; Part Status: Active; Color: Red; Lens Transparency: Clear; Mounting Type: Surface Mount; Features: -; Size / Dimension: 1.60mm L x 0.80mm W; Height (Max): 0.65mm; ComponentLink1URL: http://optoelectronics.liteon.com/upload/download/DS22-2000-223/LTST-C191KRKT.PDF; ComponentLink1Description: http://optoelectronics.liteon.com/upload/download/DS22-2000-223/LTST-C191KRKT.PDF; Supplier Part Number 1: 160-1447-6-ND; Package / Case: 0603 (1608 Metric)
R1.5 = RC0603JR-071KL: as R2.1 on sheet [01]-ATMEGA328; Supplier 1: Digi-Key; Supplier Part Number 1: 311-1.0KGRCT-ND; Manufacturer Part Number 1: RC0603JR-071KL; RoHS 1: RoHS Compliant; Description 1: RES SMD 1K OHM 5% 1/10W 0603; Stock 1: 2853955; Pricing 1: 1=0.1, 10=0.011, 100=0.0044, 1000=0.00198, 2500=0.00172 (USD); Packaging: Cut Tape (CT); Part Status: Active; Resistance (Ohms): 1k; Tolerance: ±5%; Composition: Thick Film; Features: Moisture Resistant; Operating Temperature: -55°C ~ 155°C; Package / Case: 0603 (1608 Metric); Supplier Device Package: 0603; Size / Dimension: 0.063" L x 0.031" W (1.60mm x 0.80mm); Height - Seated (Max): 0.022" (0.55mm); Failure Rate: -; ComponentLink1URL: http://www.yageo.com/documents/recent/PYu-RC_Group_51_RoHS_L_7.pdf; ComponentLink1Description: http://www.yageo.com/documents/recent/PYu-RC_Group_51_RoHS_L_7.pdf; Value: 1K
R2.5 R3.5 = RC0603FR-0710KL: as R1.1 on sheet [01]-ATMEGA328; Supplier 1: Digi-Key; Manufacturer Part Number: RC0603FR-0710KL; RoHS: RoHS Compliant; Category: Resistors; Stock 1: 16545228; Pricing 1: 1=0.1, 10=0.015, 100=0.006, 1000=0.00268, 2500=0.00233 (USD); Packaging: Cut Tape (CT); Part Status: Active; Composition: Thick Film; Features: Moisture Resistant; Operating Temperature: -55°C ~ 155°C; Package / Case: 0603 (1608 Metric); Supplier Device Package: 0603; Size / Dimension: 0.063" L x 0.032" W (1.60mm x 0.80mm); Height - Seated (Max): 0.022" (0.55mm); Failure Rate: -; ComponentLink1URL: http://www.yageo.com/documents/recent/PYu-RC_Group_51_RoHS_L_7.pdf; ComponentLink1Description: http://www.yageo.com/documents/recent/PYu-RC_Group_51_RoHS_L_7.pdf; Supplier Part Number 1: 311-10.0KHRCT-ND; Value: 10K
U1.5 = LM393DR: Analogue Comparator, Dual, Differential, 2, 1.3 s, 2V to 36V, SOIC, 8; Manufacturer 1: Texas Instruments; Nominal Supply Current: 1mA; Voltage Gain: 106.02dB; Min Dual Supply Voltage: 1V; Max Dual Supply Voltage: 18V; Number of Elements: 2; Max Supply Current: 500uA; Input Bias Current: 250nA; Input Offset Voltage (Vos): 5mV; Response Time: 1.3us; Output Current: 20mA; Quiescent Current: 2.5mA; Output Type: TTL; Output Current per Channel: 6mA; Dual Supply Voltage: 9V; Operating Supply Voltage: 28V; Supplier 1: Digi-Key; Supplier Part Number 1: 296-1015-1-ND; Manufacturer Part Number 1: LM393DR; RoHS 1: Yes; Description 1: Analogue Comparator, Dual, Differential, 2, 1.3 s, 2V to 36V, SOIC, 8; Category: Amplifiers - Op Amps, Buffer, Instrumentation; Pricing 1: 1=0.43000, 10=0.34900, 25=0.31920, 100=0.23740, 250=0.21520, 500=0.17808, 1000=0.13356 (USD); Mount: Surface Mount; Case/Package: SOIC; Number of Pins: 8; Weight: 0.002561oz; Contact Plating: Tin,Matte; Min Operating Temperature: 0°C; Max Operating Temperature: 70°C; Packaging: Tape and Reel; Min Supply Voltage: 2V; Package Quantity: 2500; Max Supply Voltage: 36V; Number of Channels: 2; Max Input Current: 250nA; Length: 4.9mm; Width: 3.91mm; Height: 1.58mm; Radiation Hardening: No; RoHS Compliant: Yes; Lead Free: Lead Free; REACH SVHC: No SVHC; ComponentLink1URL: https://datasheet.ciiva.com/39121/2016348-39121652.pdf?src-supplier=Jameco; ComponentLink1Description: https://datasheet.ciiva.com/39121/2016348-39121652.pdf?src-supplier=Jameco; ComponentLink2URL: https://datasheet.ciiva.com/4463/lm2903-12174-4463248.pdf?src-supplier=Mouser; ComponentLink2Description: https://datasheet.ciiva.com/4463/lm2903-12174-4463248.pdf?src-supplier=Mouser; ComponentLink3URL: https://datasheet.ciiva.com/15131/getdatasheetpartid-247469-15131090.pdf?src-supplier=Verical; ComponentLink3Description: https://datasheet.ciiva.com/15131/getdatasheetpartid-247469-15131090.pdf?src-supplier=Verical; ComponentLink4URL: https://datasheet.ciiva.com/46390/1874624-46390523.pdf?src-supplier=Element14; ComponentLink4Description: https://datasheet.ciiva.com/46390/1874624-46390523.pdf?src-supplier=Element14; ComponentLink5URL: https://datasheet.ciiva.com/1827/lm393-1827146.pdf?src-supplier=Digi-Key; ComponentLink5Description: https://datasheet.ciiva.com/1827/lm393-1827146.pdf?src-supplier=Digi-Key; ComponentLink6URL: https://datasheet.ciiva.com/1827/lm393-1827145.pdf?src-supplier=Digi-Key; ComponentLink6Description: https://datasheet.ciiva.com/1827/lm393-1827145.pdf?src-supplier=Digi-Key; ComponentLink7URL: https://datasheet.ciiva.com/1827/lm393-1827147.pdf?src-supplier=Digi-Key; ComponentLink7Description: https://datasheet.ciiva.com/1827/lm393-1827147.pdf?src-supplier=Digi-Key; ComponentLink8URL: https://datasheet.ciiva.com/7648/1847527-7648911.pdf?src-supplier=Element14; ComponentLink8Description: https://datasheet.ciiva.com/7648/1847527-7648911.pdf?src-supplier=Element14; ComponentLink9URL: https://datasheet.ciiva.com/2970/lm2903-2970518.pdf?src-supplier=Avnet; ComponentLink9Description: https://datasheet.ciiva.com/2970/lm2903-2970518.pdf?src-supplier=Avnet; ComponentLink10URL: https://datasheet.ciiva.com/26210/lm2903-26210635.pdf?src-supplier=Avnet+Europe; ComponentLink10Description: https://datasheet.ciiva.com/26210/lm2903-26210635.pdf?src-supplier=Avnet+Europe
VR1.5 = Variable Resistor: Square Trimming Potentiometer; AEMS Code: 1400226